# Altium project eLFL V3.PrjPcb
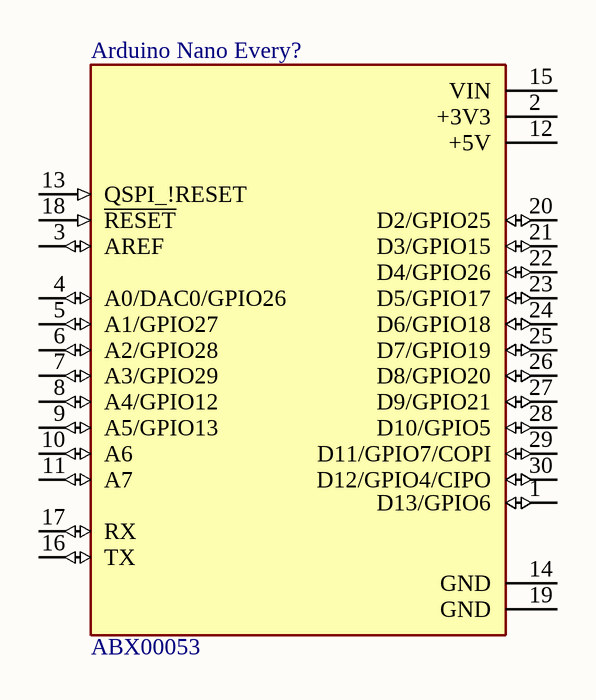
[diagram p0: MCU.SchDoc]
CAGE_CODE: ?????; CONTRACT_NUMBER: <CONTRACT NO>; DOC_NO_ASSY_DWG: <ASSY DWG NO>; DOC_NO_BOM: <BOM DOC NO>; DOC_NO_FAB_DWG: <FAB DWG NO>; DOC_NO_SCH_DWG: <SCH DWG NO>; PCB_2_DEC_TOL: +/-.01; PCB_3_DEC_TOL: +/-.010; PCB_ANG_TOL: +/-1/2; PCB_ASSEMBLY_NO: <PCB ASSY NO>; PCB_CHECKER: - -----; PCB_CHECKER_APP_DATE: --/--/----; PCB_DESIGNER: - -----; PCB_DESIGNER_APP_DATE: --/--/----; PCB_DWG_NO: <PCB DWG NO>; PCB_ENGINEER: - -----; PCB_ENGINEER_APP_DATE: --/--/----; PCB_PART_NUMBER: <PCB PN>; PCB_REV: A; SCH_REV: A
3 sheets, 8 parts. Net scope: global (net labels, ports and power ports of the same name join across sheets).
Board file: PCB1.PcbDoc
Sheets:
  Connectors.SchDoc
  MCU.SchDoc
  ICs.SchDoc

## Sheet Connectors.SchDoc
size 431 x 279 mm; ENG_APP_DATE: --/--/--; DSN_APP_DATE: --/--/--; CHK_APP_DATE: --/--/--

### Notes on the sheet
- DWG. NO.
- REV.
- SHT.
- THIS DOCUMENT AND THE DATA DISCLOSED HEREIN OR HEREWITH IS THE PROPERTY OF ALTIUM LIMITED AND MAY BE FREELY DISTRIBUTED IN WHOLE. NO RIGHTS ARE RESERVED OR EXPRESS OR IMPLIED WARANTEE GIVEN.
- REVISION
- DESCRIPTION
- DATE
- APPROVED
- ENG:
- APPROVALS
- PROJECT
- DSN:
- CHK:
- REFERENCE DOCUMENTS
- PROJECT REVISION:
- TITLE
- DOCUMENT REVISION:
- DESIGN ITEM:
- BOM:
- FAB DWG:
- PCB DWG:
- ASSY DWG:
- SCALE:
- SIZE
- B
- CAGE CODE
- FILE NAME
- DWG NO.
- SHEET
- OF
- REV

## Sheet MCU.SchDoc
size A; SheetNumber: 2; SheetTotal: 3

### Parts
Arduino_Nano_Every?  ABX00053  [Arduino Nano Every]

### Nets

Not connected (* = marked no-connect by the designer): Arduino_Nano_Every? 1(D13/GPIO6) 2(+3V3) 3(AREF) 4(A0/DAC0/GPIO26) 5(A1/GPIO27) 6(A2/GPIO28) 7(A3/GPIO29) 8(A4/GPIO12) 9(A5/GPIO13) 10(A6) 11(A7) 12(+5V) 13(QSPI_!RESET) 14(GND) 15(VIN) 16(TX) 17(RX) 18(~{RESET}) 19(GND) 20(D2/GPIO25) 21(D3/GPIO15) 22(D4/GPIO26) 23(D5/GPIO17) 24(D6/GPIO18) 25(D7/GPIO19) 26(D8/GPIO20) 27(D9/GPIO21) 28(D10/GPIO5) 29(D11/GPIO7/COPI) 30(D12/GPIO4/CIPO)

### Library data of the parts
Arduino_Nano_Every? = ABX00053: ARDUINO NANO RP2040 CONNECT WITH; MF: {'manufacturer': u'Arduino'}; Package: None; Value: *; MP: ABX00053; Availability: Unavailable; Price: None

## Sheet ICs.SchDoc
size A; SheetNumber: 3; SheetTotal: 3
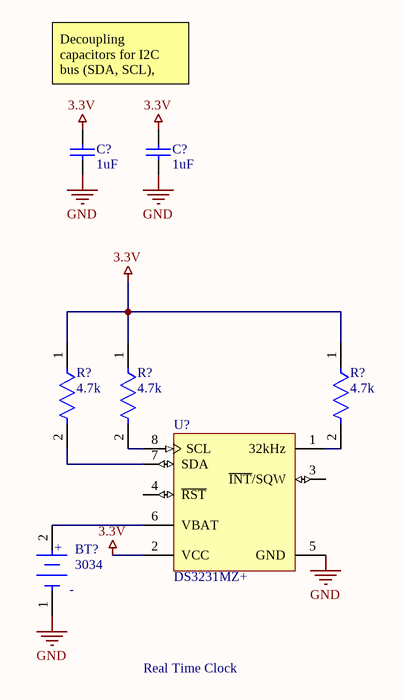
[diagram p1: ICs.SchDoc]

### Parts
(Parts that share a designator on the sheet are numbered #1, #2 ... from top to bottom, then left to right.)
BT?  3034  [FP-3034-MFG]
C?#1  1uF  [CAPC2013X140X50LL20T25]
C?#2  1uF  [CAPC2013X140X50LL20T25]
R?#1  4.7k  [FP-CRCW0805-e3-MFG]
R?#2  4.7k  [FP-CRCW0805-e3-MFG]
R?#3  4.7k  [FP-CRCW0805-e3-MFG]
U?  DS3231MZ+  [S8MK+1_N]

### Nets
3.3V: C?#1.2 C?#2.2 R?#1.1 R?#2.1 R?#3.1 U?.2(VCC)
GND: BT?.1(C) C?#1.1 C?#2.1 U?.5(GND)
NetBT?_2: BT?.2(A) U?.6(VBAT)
NetR?#1_2: R?#1.2 U?.7(SDA)
NetR?#2_2: R?#2.2 U?.8(SCL)
NetR?#3_2: R?#3.2 U?.1(32kHz)

Not connected (* = marked no-connect by the designer): U? 3(~{INT}/SQW) 4(~{RST})

### Notes on the sheet
- Decoupling capacitors for I2C bus (SDA, SCL), VCC for RTC
- Real Time Clock
- (in symbol CMP-19636-000006-1) +; -

### Library data of the parts
BT? = CMP-19636-000006-1: BATTERY RETAINER COIN 20MM SMD; Manufacturer: Keystone Electronics; Number Of Contacts: 2; Description: Coin Cell Battery Holders COIN CELL RETAINER; Height: 4.31mm; Device Class L1: Connectors; Device Class L3: unset; RoHS: TRUE; Automotive: No; Mouser Description: Coin Cell Battery Holders COIN CELL RETAINER; Contact Material: Nickel; Digikey Description: BATTERY RETAINER COIN 20MM SMD; Category: Batt; Package: 3034; ComponentLink2URL: https://www.keyelco.com/product-pdf.cfm?p=798; Manufacturer Part Number: 3034; Octopart: https://octopart.com/3034-keystone-27554462; ComponentLink2Description: Datasheet; Device Class L2: unset; Lead Free: Yes
C?#1 C?#2 = CMP-2007-03234-1: Part Number: C0805C105K3RACTU; Manufacturer: Kemet
R?#1-R?#3 = CMP-2001-03971-2: RES Thick Film, 4.87kΩ, 1%, 0.125W, 100ppm/°C, 0805; Voltage Rating: 150V; Resistance: 4.87kR; Power Rating: 125mW; Length: 2mm; Contact Plating: Tin; Min Operating Temperature: -55°C; Width: 0.049inch; Composition: Thick Film; Height: 0.45mm; Case Code (Imperial): 0805; Depth: 1.25mm; Tolerance: 1%; Number of Terminations: 2; Features: Automotive AEC-Q200; Number of Pins: 2; Case/Package: 0805; Termination: SMD/SMT; Military Standard: Not; Lead Free: Lead Free; Radiation Hardening: No; Case Code (Metric): 2012; Packaging: Tape and Reel; Max Power Dissipation: 125mW; Voltage Rating (DC): 150V; Package Quantity: 10; Max Operating Temperature: 155°C; Weight: 0.000194oz; Temperature Coefficient: 100ppm/°C
U? = CMP-0254-00001-2: +/-5ppm, MEMS based Real-Time Clock, I2C Interface, 8-Pin SO, -40 to 85 degC, Pb-Free; PackageVersion: revC, 2010; ComponentLink3Description: Package Specification; ComponentLink3URL: http://pdfserv.maxim-ic.com/package_dwgs/21-0041.PDF; PackageReference: S8MK+1; DatasheetVersion: Rev 3, Dec-2011; ComponentLink1Description: Manufacturer URL; ComponentLink2Description: Datasheet; PackageDescription: 8-Pin Small-Outline IC, Narrow (0.15in), 1.27 mm Pitch, SOIC (N), Pb-Free; Code_IPC: SOIC127P600-8; ComponentLink1URL: http://www.maxim-ic.com; Code_JEDEC: MS-012-AA; ComponentLink2URL: http://datasheets.maxim-ic.com/en/ds/DS3231M.pdf